# Altium project PCB_Project.PrjPcb
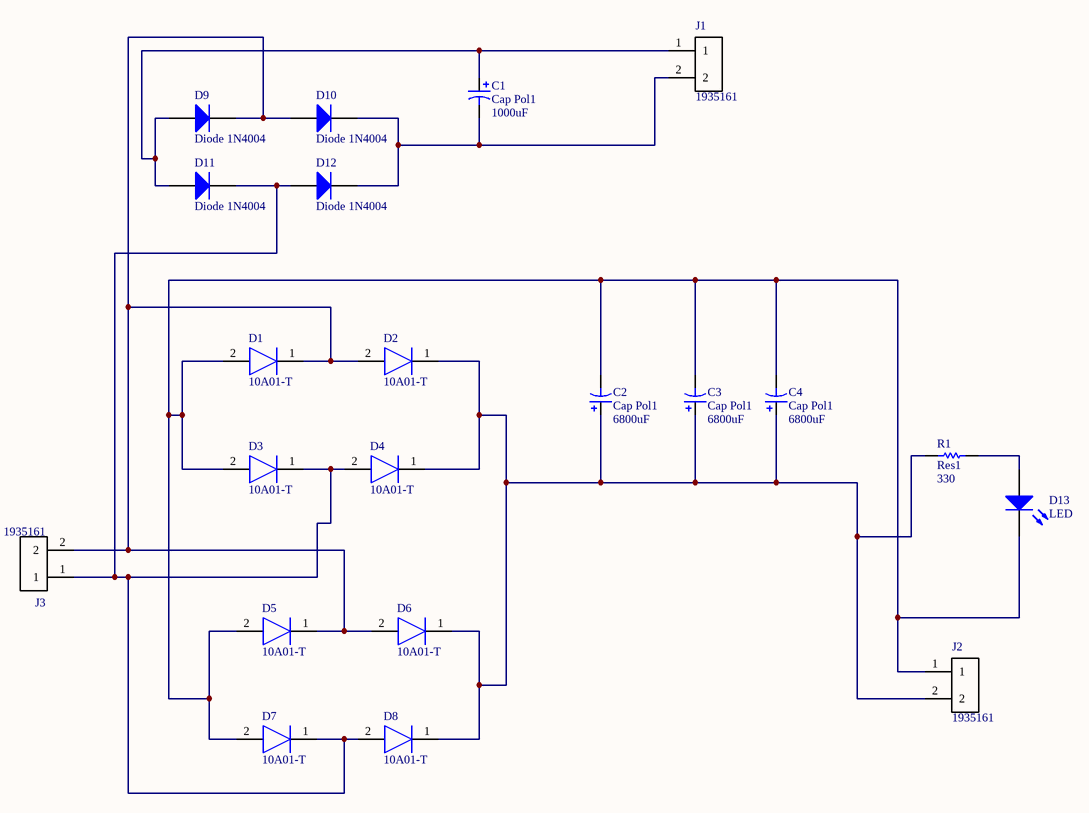
[diagram p0: Sheet2.SchDoc]
1 sheet, 21 parts. Net scope: global (net labels, ports and power ports of the same name join across sheets).
Board file: PCB2.PcbDoc

## Sheet Sheet2.SchDoc
size Letter

### Parts
C1  Cap Pol1  value 1000uF  [RB7.6-15]
C2  Cap Pol1  value 6800uF  [RB7.6-15]
C3  Cap Pol1  value 6800uF  [RB7.6-15]
C4  Cap Pol1  value 6800uF  [RB7.6-15]
D1  10A01-T  [DIOAD4425W130L885D885]
D2  10A01-T  [DIOAD4425W130L885D885]
D3  10A01-T  [DIOAD4425W130L885D885]
D4  10A01-T  [DIOAD4425W130L885D885]
D5  10A01-T  [DIOAD4425W130L885D885]
D6  10A01-T  [DIOAD4425W130L885D885]
D7  10A01-T  [DIOAD4425W130L885D885]
D8  10A01-T  [DIOAD4425W130L885D885]
D9  Diode 1N4004  [DO-41]
D10  Diode 1N4004  [DO-41]
D11  Diode 1N4004  [DO-41]
D12  Diode 1N4004  [DO-41]
D13  LED  [LED-1]
J1  1935161  [*PHOENIX_1935161]
J2  1935161  [*PHOENIX_1935161]
J3  1935161  [*PHOENIX_1935161]
R1  Res1  value 330  [AXIAL-0.3]

### Nets
NetC1_1: C1.1 D9.1(A) D11.1(A) J1.1
NetC1_2: C1.2 D10.2(K) D12.2(K) J1.2
NetC2_1: C2.1 C3.1 C4.1 D2.1(K) D4.1(K) D6.1(K) D8.1(K) J2.2 R1.1
NetC2_2: C2.2 C3.2 C4.2 D1.2(A) D3.2(A) D5.2(A) D7.2(A) D13.2(K) J2.1
NetD1_1: D1.1(K) D2.2(A) D5.1(K) D6.2(A) D9.2(K) D10.1(A) J3.2
NetD3_1: D3.1(K) D4.2(A) D7.1(K) D8.2(A) D11.2(K) D12.1(A) J3.1
NetD13_1: D13.1(A) R1.2

### Library data of the parts
C1-C4 = Cap Pol1: Polarized Capacitor (Radial); Published: 8-Jun-2000; LatestRevisionDate: 17-Jul-2002; LatestRevisionNote: Re-released for DXP Platform.; PackageReference: RB7.6-15; Publisher: Altium Limited; PackageDescription: Polarized Capacitor (Radial); 2 Leads
D1-D8 = 10A01-T: Diode; Manufacturer_Name: Diodes Inc.; Allied_Number: 70437181; Datasheet Link: https://componentsearchengine.com/Datasheets/1/10A01-T.pdf; Manufacturer_Part_Number: 10A01-T; Mouser Part Number: 621-10A01-T; Mouser Price/Stock: https://www.mouser.com/Search/Refine.aspx?Keyword=621-10A01-T; RS Part Number: 9228248; RS Price/Stock: http://uk.rs-online.com/web/p/products/9228248; Allied Price/Stock: https://www.alliedelec.com/diodes-inc-10a01-t/70437181/
D9-D12 = Diode 1N4004: 1 Amp General Purpose Rectifier; Published: 8-Jun-2000; LatestRevisionDate: 17-Jul-2002; LatestRevisionNote: Re-released for DXP Platform.; DatasheetVersion: 1998; PackageVersion: Aug-1999; PackageReference: DO-41; Publisher: Altium Limited; PackageDescription: Diode, Axial; Body 5.2 x 2.7 mm (LxDia. max), Lead Dia. 0.86 mm (max); Code_JEDEC: DO-204-AL; ComponentLink1Description: Manufacturer Link; ComponentLink1URL: http://www.fairchildsemi.com/; ComponentLink2Description: Datasheet; ComponentLink2URL: http://www.fairchildsemi.com/ds/1N%2F1N4001.pdf
D13 = LED1: Typical RED GaAs LED; Published: 8-Jun-2000; LatestRevisionDate: 08-Jul-2005; LatestRevisionNote: Mech Layer 1 removed.; PackageReference: LED-1; Publisher: Altium Limited; PackageDescription: LED; 2 Leads
J1-J3 = 1935161: Conn Terminal Blocks 2 POS 5mm Solder ST Thru-Hole 16A; MF: Phoenix Contact; Package: None; Price: None; MP: 1935161; Availability: Unavailable; SnapEDA_Link: https://www.snapeda.com/parts/1935161/Phoenix%20Contact/view-part/?ref=snap; Value: *
R1 = Res1: Resistor; Published: 8-Jun-2000; LatestRevisionDate: 17-Jul-2002; LatestRevisionNote: Re-released for DXP Platform.; PackageReference: AXIAL-0.3; Publisher: Altium Limited; PackageDescription: Axial Device, Thru-Hole; 2 Leads; 0.3 in Pin Spacing